# EAGLE design power_control (EAGLE 6.4)

## Sheet 1 of 4: Power
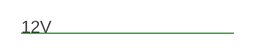
[diagram p0: schematic, sheet 1]

## Sheet 2 of 4: B-t-B
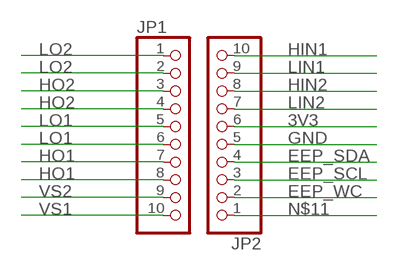
[diagram p1: schematic, sheet 2]

### Parts
JP1  PINHD-1X10_2.54-SMD  [1X10SMD]
JP2  PINHD-1X10_2.54-SMD  [1X10SMD]

### Nets
3V3: JP2.6 ; also sheet 4
EEP_SCL: JP2.3 ; also sheet 4
EEP_SDA: JP2.4 ; also sheet 4
EEP_WC: JP2.2 ; also sheet 4
GND: JP2.5 ; also sheet 3,4
HIN1: JP2.10 ; also sheet 3
HIN2: JP2.8 ; also sheet 3
HO1: JP1.7 JP1.8 ; also sheet 3
HO2: JP1.3 JP1.4 ; also sheet 3
LIN1: JP2.9 ; also sheet 3
LIN2: JP2.7 ; also sheet 3
LO1: JP1.5 JP1.6 ; also sheet 3
LO2: JP1.1 JP1.2 ; also sheet 3
N$11: JP2.1
VS1: JP1.10 ; also sheet 3
VS2: JP1.9 ; also sheet 3

## Sheet 3 of 4: IR2101
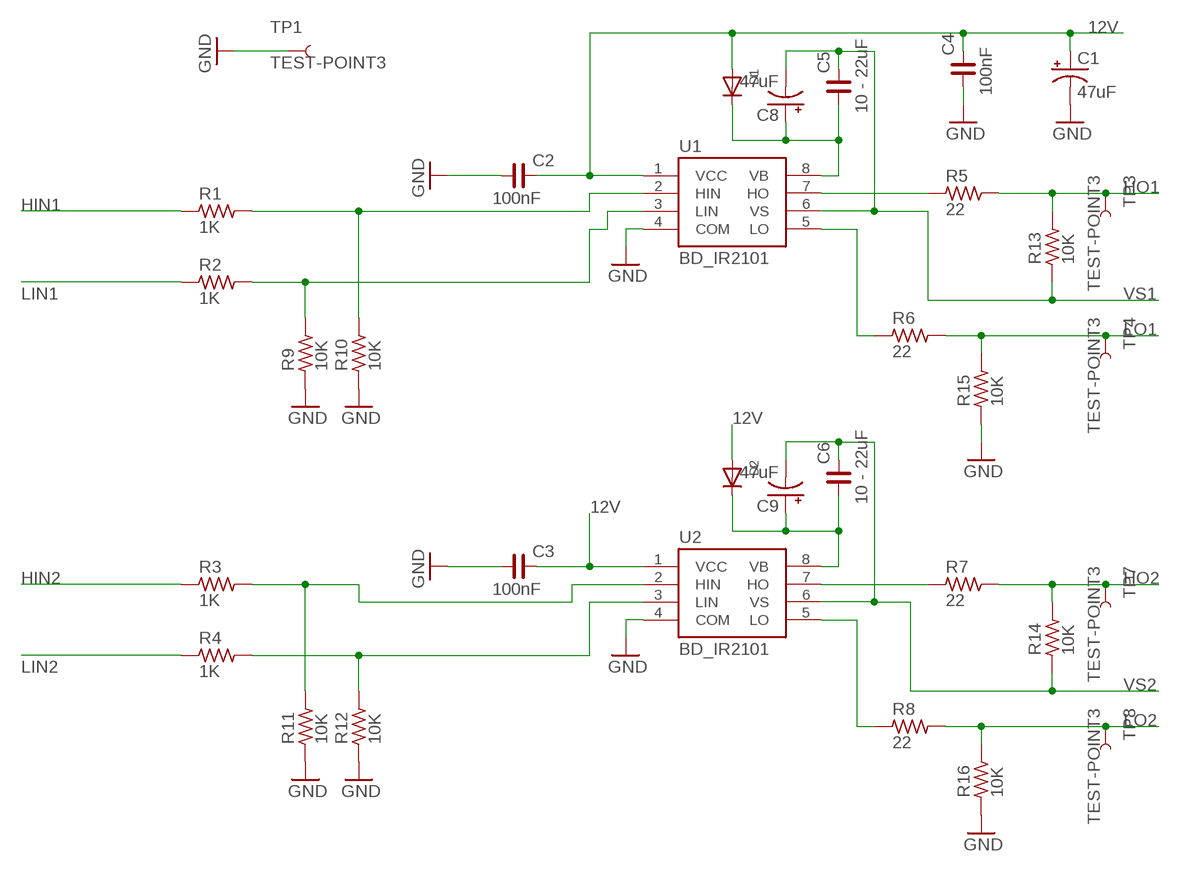
[diagram p2: schematic, sheet 3]

### Parts
C1  47uF  CPOL-USB/3528-21W  [B/3528-21W]
C2  100nF  C_0201  [C0201]
C3  100nF  C_0201  [C0201]
C4  100nF  C_0201  [C0201]
C5  10 - 22uF  C_0805  [C0805]
C6  10 - 22uF  C_0805  [C0805]
C8  47uF  CPOL-USB/3528-21W  [B/3528-21W]
C9  47uF  CPOL-USB/3528-21W  [B/3528-21W]
D1  DIODESOD-523  [SOD-523]
D2  DIODESOD-523  [SOD-523]
R1  1K  R_0201  [R0201]
R2  1K  R_0201  [R0201]
R3  1K  R_0201  [R0201]
R4  1K  R_0201  [R0201]
R5  22  R_0805  [R0805]
R6  22  R_0805  [R0805]
R7  22  R_0805  [R0805]
R8  22  R_0805  [R0805]
R9  10K  R_0201  [R0201]
R10  10K  R_0201  [R0201]
R11  10K  R_0201  [R0201]
R12  10K  R_0201  [R0201]
R13  10K  R_0805  [R0805]
R14  10K  R_0805  [R0805]
R15  10K  R_0805  [R0805]
R16  10K  R_0805  [R0805]
TP1  TEST-POINT3  [PAD.03X.03]
TP3  TEST-POINT3  [PAD.03X.03]
TP4  TEST-POINT3  [PAD.03X.03]
TP7  TEST-POINT3  [PAD.03X.03]
TP8  TEST-POINT3  [PAD.03X.03]
U1  BD_IR2101  [SO8]
U2  BD_IR2101  [SO8]

### Nets
12V: C1.+ C2.2 C3.2 C4.2 D1.A D2.A U1.1(VCC) U2.1(VCC) ; also sheet 1
GND: C1.- C2.1 C3.1 C4.1 R9.1 R10.1 R11.1 R12.1 R15.1 R16.1 TP1.P$1 U1.4(COM) U2.4(COM) ; also sheet 2,4
HIN1: R1.1 ; also sheet 2
HIN2: R3.1 ; also sheet 2
HO1: R5.2 R13.2 TP3.P$1 ; also sheet 2
HO2: R7.2 R14.2 TP7.P$1 ; also sheet 2
LIN1: R2.1 ; also sheet 2
LIN2: R4.1 ; also sheet 2
LO1: R6.2 R15.2 TP4.P$1 ; also sheet 2
LO2: R8.2 R16.2 TP8.P$1 ; also sheet 2
N$1: C6.1 C9.+ D2.K(C) U2.8(VB)
N$2: C5.1 C8.+ D1.K(C) U1.8(VB)
N$7: R1.2 R10.2 U1.2(HIN)
N$12: R2.2 R9.2 U1.3(LIN)
N$18: R5.1 U1.7(HO)
N$20: R6.1 U1.5(LO)
N$33: R3.2 R11.2 U2.2(HIN)
N$34: R4.2 R12.2 U2.3(LIN)
N$38: R7.1 U2.7(HO)
N$40: R8.1 U2.5(LO)
VS1: C5.2 C8.- R13.1 U1.6(VS) ; also sheet 2
VS2: C6.2 C9.- R14.1 U2.6(VS) ; also sheet 2

## Sheet 4 of 4: EEPROM
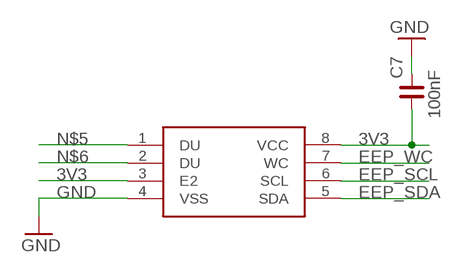
[diagram p3: schematic, sheet 4]

### Parts
C7  100nF  C_0201  [C0201]
M24M02  M24M02-DRMN6TP  [SO08]

### Nets
3V3: C7.1 M24M02.3(E2) M24M02.8(VCC) ; also sheet 2
EEP_SCL: M24M02.6(SCL) ; also sheet 2
EEP_SDA: M24M02.5(SDA) ; also sheet 2
EEP_WC: M24M02.7(WC) ; also sheet 2
GND: C7.2 M24M02.4(VSS) ; also sheet 2,3
N$5: M24M02.1(DU)
N$6: M24M02.2(DU)

## Library data of the parts
C1 C8 C9 = adafruit:CPOL-US: POLARIZED CAPACITOR, American symbol
C2-C7 = rc-master-smd:C_: NON-POLARIZED CAP
D1 D2 = adafruit:DIODE: Diode SMADIODE - SMA Surface Mount Package 20V 1A Schottky Diode Digikey: 641-1014-6-ND DO-1N4148 - Through Hole Small Current Diode SOD-123 20V 1 A (.5mV Vf) Schottky Diode - Digikey: MBRX120TPMSCT-ND SOD-323 10V 570mA (.38mV Vf, 3ns) Schottky Diode - Digikey: ZLLS410CT-ND SOD-523 30V 30mA Schottky Diode (RB751S-40TE61) - Digikey: RB751S-40TE61CT-ND SOT23-R/W - SOT23 Package (R = Solder Paste/Reflow Ovens, W = Hand-Soldering) BAT54Film 40V 300mA - Digikey: 497-7162-1-ND
JP1 JP2 = pinhead-1:PINHD-1X10: PIN HEADER
M24M02 = st-microelectronics:M24M02-DRMN6TP
R1-R16 = rc-master-smd:R_: RESISTOR
TP1 TP3 TP4 TP7 TP8 = SparkFun-Passives:TEST-POINT: Bare copper test points for troubleshooting or ICT
U1 U2 = open-bldc:BD

## Board
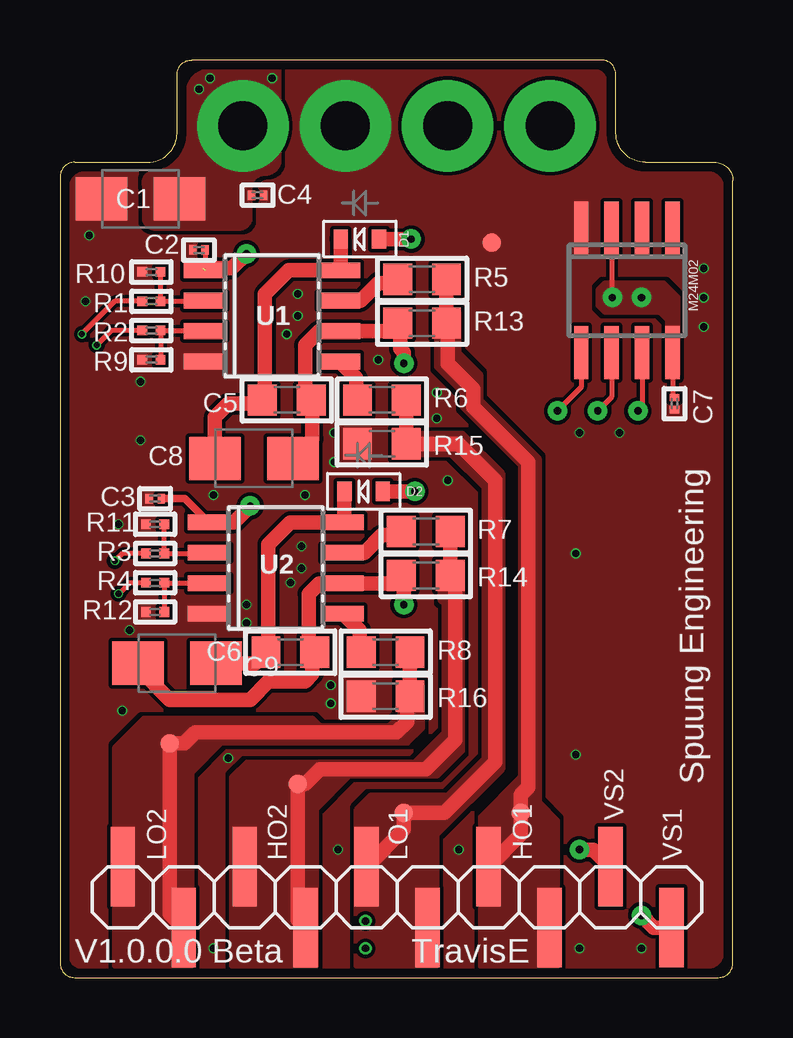
[diagram p4: board, top side]
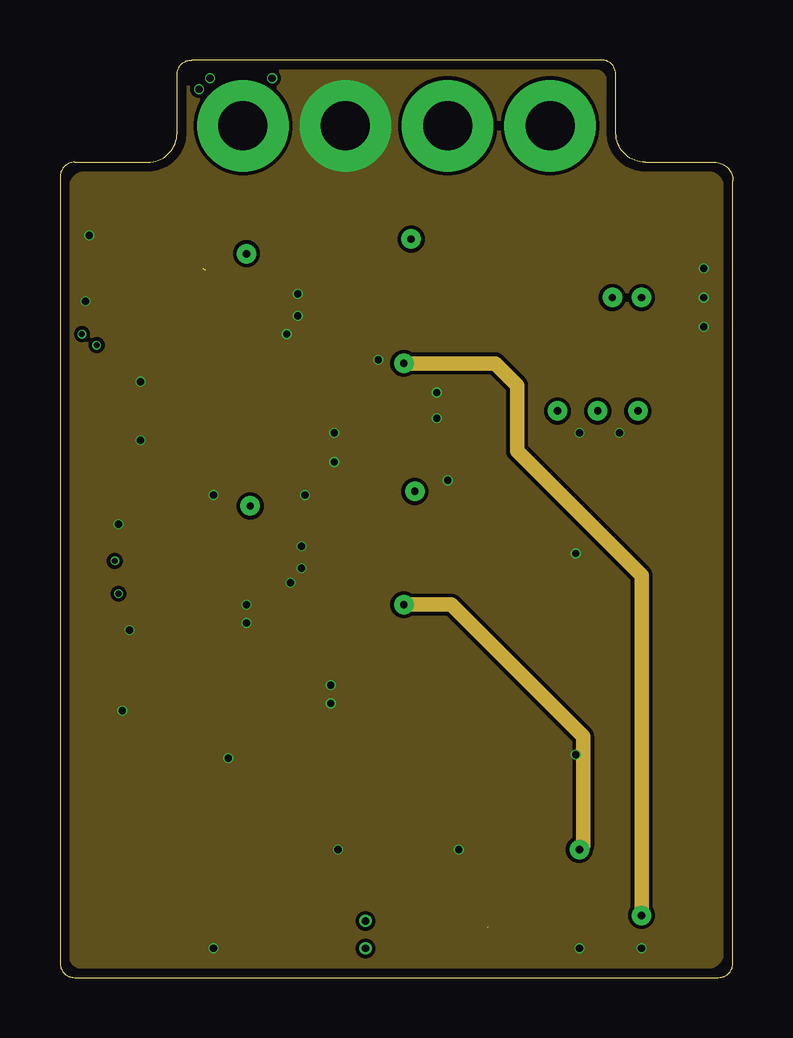
[diagram p5: board, inner layer Route2]
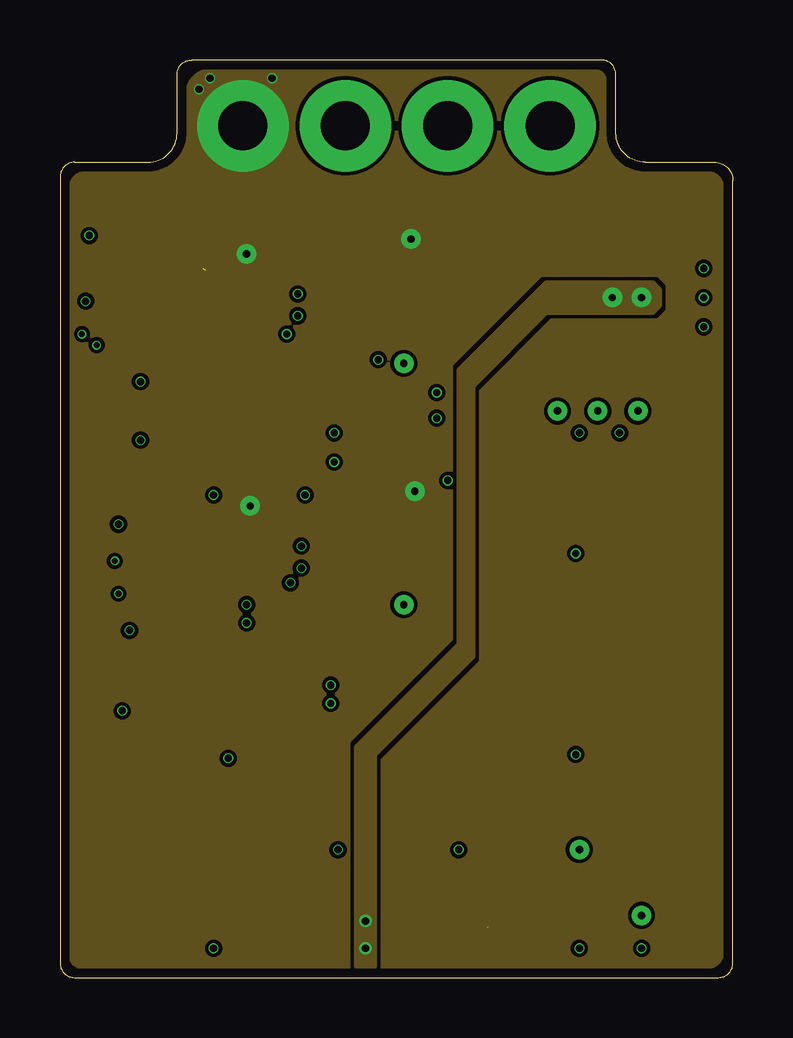
[diagram p6: board, inner layer Route3]
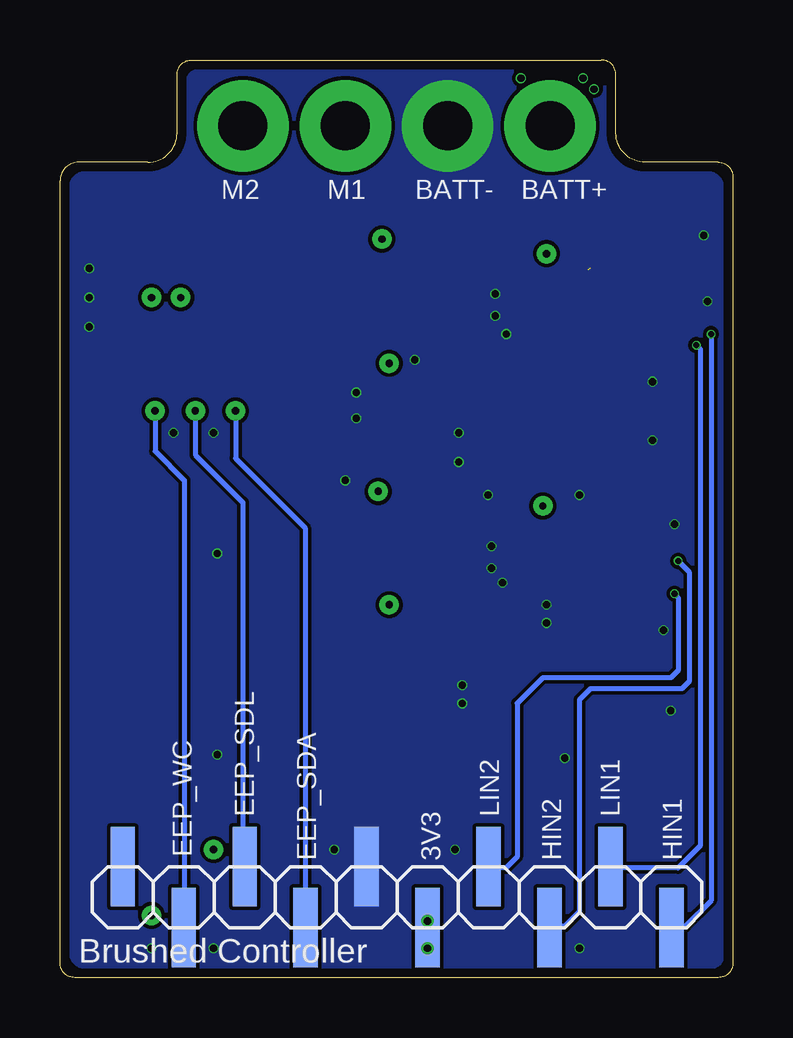
[diagram p7: board, bottom side, seen from below]

Size 28.04 x 38.25 mm. Coordinates in mm from the lower left corner, seen from the top.
Outline: 0.61,0 27.43,0 arc90 28.04,0.61 28.04,33.22 arc90 27.28,33.99 24.38,33.99 arc-90 23.17,35.2 23.17,37.64 arc90 22.56,38.25 5.49,38.25 arc90 4.88,37.64 4.88,35.2 arc-90 3.66,33.99 0.61,33.99 arc90 0,33.38 0,0.61 arc90 0.61,0
Copper layers (1*2*3*16): Top 0.035559375mm / dielectric 0.17018125mm / Route2 0.01778125mm / dielectric 47mil / Route3 0.01778125mm / dielectric 0.17018125mm / Bottom 0.035559375mm
Design rules "LaenPCBOrder *": minimum track width 5mil, minimum drill 10mil, track to track 6mil, track to pad 6mil, pad to pad 6mil, via to via 6mil, smd to smd 6mil, copper to edge 15mil, drill to drill 6mil, minimum pad ring 1mil, minimum via ring 1mil, stop-mask expansion 4mil, vias tented up to drill 13mil, thermal gap 10mil

### Footprints (pad centres in the part's own frame; a part is rotated, then mirrored left to right if it is on the bottom)
B/3528-21W = smd 2.15 x 1.8: + 1.625,0; - -1.625,0
C0201 = smd 0.3 x 0.4: 1 -0.254,0; 2 0.254,0
C0805 = smd 1.2 x 1.3: 1 -1.016,0; 2 1.016,0
SOD-523 = smd 0.8 x 0.6: A 0,-0.8; K 0,0.8
1X10SMD = smd 1.016 x 3.302: 1 -1.27,1.27; 2 1.27,-1.27; 3 3.81,1.27; 4 6.35,-1.27; 5 8.89,1.27; 6 11.43,-1.27; 7 13.97,1.27; 8 16.51,-1.27; 9 19.05,1.27; 10 21.59,-1.27
SO08 = smd 0.6 x 2.2: 1 -1.905,-2.6; 2 -0.635,-2.6; 3 0.635,-2.6; 4 1.905,-2.6; 5 1.905,2.6; 6 0.635,2.6; 7 -0.635,2.6; 8 -1.905,2.6
R0201 = smd 0.4 x 0.4: 1 -0.381,0; 2 0.381,0
R0805 = smd 1.2 x 1.3: 1 -1.016,0; 2 1.016,0
PAD.03X.03 = smd 0.762 x 0.762: P$1 0,0
SO8 = smd 0.65 x 1.75: 1 -1.905,-2.8; 2 -0.635,-2.8; 3 0.635,-2.8; 4 1.905,-2.8; 5 1.905,2.8; 6 0.635,2.8; 7 -0.635,2.8; 8 -1.905,2.8

### Placement (x,y rotation side)
C1  3.35,32.46 0 top
C2  5.79,30.33 0 top
C3  3.96,19.96 0 top
C4  8.23,32.61 180 top
C5  9.45,24.08 0 top
C6  9.6,13.56 0 top
C7  25.6,23.93 270 top
C8  8.08,21.64 180 top
C9  4.88,13.11 0 top
D1  12.5,30.78 90 top
D2  12.65,20.27 90 top
JP1  3.89,3.35 0 top
JP2  24.16,3.35 0 bottom
M24M02  23.62,28.65 180 top
R1  3.81,28.19 0 top
R2  3.81,26.97 0 top
R3  3.96,17.68 0 top
R4  3.96,16.46 0 top
R5  15.09,29.11 0 top
R6  13.41,24.08 0 top
R7  15.24,18.59 0 top
R8  13.56,13.56 0 top
R9  3.81,25.76 0 top
R10  3.81,29.41 0 top
R11  3.96,18.9 0 top
R12  3.96,15.24 0 top
R13  15.09,27.28 0 top
R14  15.24,16.76 0 top
R15  13.41,22.25 0 top
R16  13.56,11.73 0 top
TP1  17.98,30.63 0 top
TP3  19.2,6.86 0 top
TP4  14.33,6.86 0 top
TP7  9.91,8.08 0 top
TP8  4.57,9.75 0 top
U1  8.84,27.58 270 top
U2  8.99,17.07 270 top

### Tracks (layer width: path | path; a pad name or v marks a point on that pad's centre or on a via)
3V3  (via drill 0.3 pad 0.51, 0.3 pad 0.81)
  Top 0.203: M24M02.8 25.53,24.26 C7.1 | M24M02.3 22.99,28.37 v23.01,28.35
  Bottom 0.61: JP2.6 v12.73,2.36
  other vias: 24.23,28.35 12.73,1.22
  pour Top (no thermals): 25.3,25.15 25.76,25.15 25.76,28.35 25.15,28.96 22.71,28.96 22.4,28.65 22.4,28.04 22.71,27.74 24.99,27.74 25.3,27.43
  pour Route3 (rank 5): 24.69,28.96 20.27,28.96 16.61,25.3 16.61,13.87 12.34,9.6 12.34,0.46 13.11,0.46 13.11,9.3 17.22,13.41 17.22,24.69 20.27,27.74 24.69,27.74 24.99,28.04 24.99,28.65
12V  (via drill 0.3 pad 0.41, 0.3 pad 0.81, 2.03 pad 3.81)  (1 unrouted)
  Top 0.203: C2.2 U1.1
  Top 0.305: C3.2 5.2,19.96 U2.1
  Top 0.61: D1.A v14.63,30.78 | D2.A v14.78,20.27 | 5.94,29.57 7.16,29.57 v7.77,30.18 | U2.1 7.24,18.97 v7.93,19.66
  other vias: 7.62,35.51 6.25,37.49 8.84,37.49 5.79,37.03
  pour Route3 (rank 6): 22.25,37.8 6.25,37.8 arc90 5.33,36.88 5.33,35.36 arc-90 3.51,33.53 1.07,33.53 arc90 0.46,32.92 0.46,0.91 arc90 0.91,0.46 26.97,0.46 arc90 27.58,1.07 27.58,32.92 arc90 26.97,33.53 24.38,33.53 arc-90 22.71,35.2 22.71,37.34 arc90
  pour Top (rank 5, no thermals): 9.14,37.8 6.25,37.8 arc90 5.33,36.88 5.33,35.2 arc-90 3.81,33.53 arc90 3.51,33.07 3.51,31.7 arc90 3.96,31.24 7.47,31.24 arc90 7.92,31.7 7.92,32.92 arc-90 8.53,33.53 arc90 9.14,34.14
EEP_SCL  (via drill 0.3 pad 0.81)
  Top 0.203: M24M02.6 22.99,24.21 v22.4,23.62
  Bottom 0.203: v22.4,23.62 22.4,21.79 20.42,19.81 20.42,4.7 JP2.3
EEP_SDA  (via drill 0.3 pad 0.81)  (1 unrouted)
  Top 0.203: M24M02.5 21.72,24.61 v20.73,23.62
  Bottom 0.203: v20.73,23.62 20.73,21.64 17.83,18.75 17.83,2.11
EEP_WC  (via drill 0.3 pad 0.81)
  Top 0.203: M24M02.7 24.26,23.8 v24.08,23.62
  Bottom 0.203: v24.08,23.62 24.08,21.95 22.86,20.73 22.86,2.26 JP2.2
GND  (via drill 0.3 pad 0.41, 2.03 pad 3.81)
  other vias: 11.89,35.51 2.59,11.13 9.91,28.5 9.91,27.58 10.06,17.07 2.44,18.9 9.45,26.82 15.7,24.38 15.7,23.32 26.82,29.57 26.82,28.35 26.82,27.13 21.64,22.71 23.32,22.71 10.06,17.98 9.6,16.46 16.15,20.73 21.49,9.3 21.49,17.68 7.01,9.14 11.58,5.33 16.61,5.33 2.9,14.48 3.35,24.84 3.35,22.4 1.22,30.94 1.07,28.19 10.21,20.12 6.4,20.12 13.26,25.76 21.64,1.22 24.23,1.22 11.28,12.19 11.28,11.43 11.43,22.71 11.43,21.49 7.77,15.54 7.77,14.78 6.4,1.22
  pour Top (rank 6, no thermals): 22.25,37.8 6.25,37.8 arc90 5.33,36.88 5.33,35.36 arc-90 3.51,33.53 1.07,33.53 arc90 0.46,32.92 0.46,0.91 arc90 0.91,0.46 26.97,0.46 arc90 27.58,1.07 27.58,32.92 arc90 26.97,33.53 24.38,33.53 arc-90 22.71,35.2 22.71,37.34 arc90
  pour Bottom (rank 6, no thermals): 22.25,37.8 6.25,37.8 arc90 5.33,36.88 5.33,35.36 arc-90 3.51,33.53 1.07,33.53 arc90 0.46,32.92 0.46,0.91 arc90 0.91,0.46 26.97,0.46 arc90 27.58,1.07 27.58,32.92 arc90 26.97,33.53 24.38,33.53 arc-90 22.71,35.2 22.71,37.34 arc90
  pour Route2 (rank 5): 22.25,37.8 6.25,37.8 arc90 5.33,36.88 5.33,35.36 arc-90 3.51,33.53 1.07,33.53 arc90 0.46,32.92 0.46,0.91 arc90 0.91,0.46 26.97,0.46 arc90 27.58,1.07 27.58,32.92 arc90 26.97,33.53 24.38,33.53 arc-90 22.71,35.2 22.71,37.34 arc90
HIN1  (via drill 0.25 pad 0.36)
  Top 0.203: R1.1 2.29,28.19 v0.91,26.82
  Bottom 0.203: v0.91,26.82 0.91,3.2 1.98,2.13 2.52,2.13 JP2.10
HIN2  (via drill 0.25 pad 0.36)
  Top 0.203: R3.1 2.59,17.68 v2.29,17.37
  Bottom 0.203: v2.29,17.37 1.83,16.92 1.83,12.34 2.13,12.04 5.94,12.04 6.4,11.58 6.4,2.74 7.01,2.13 7.59,2.13 JP2.8
HO1
  Top 0.61: R5.2 R13.2 16.15,27.23 16.15,25.6 17.22,24.54 17.22,23.77 19.51,21.49 19.51,7.92 19.2,7.62 TP3.P$1 19.2,5.97 JP1.7
  pour Top (rank 5, no thermals): 20.73,0.46 17.53,0.46 17.53,6.71 19.2,8.38 19.2,21.34 16.76,23.77 16.76,24.38 15.7,25.45 15.7,27.74 16.61,27.74 16.61,26.06 17.53,25.15 17.53,24.08 19.96,21.64 19.96,7.32 20.73,6.55
HO2
  Top 0.61: R7.2 R14.2 16.46,16.56 16.46,9.91 15.24,8.69 10.82,8.69 10.21,8.08 TP7.P$1 9.91,2.41 JP1.4
  pour Top (rank 5, no thermals): 10.67,0.46 7.16,0.46 7.16,8.38 7.77,8.99 14.78,8.99 16,10.21 16,15.54 15.85,15.7 15.85,17.22 16.76,17.22 16.76,9.45 15.7,8.38 12.04,8.38 10.67,7.01
LIN1  (via drill 0.25 pad 0.36)
  Top 0.203: R2.1 2.13,26.97 v1.52,26.37
  Bottom 0.203: v1.52,26.37 1.37,26.21 1.37,5.49 2.29,4.57 5.05,4.57 JP2.9
LIN2  (via drill 0.25 pad 0.36)
  Top 0.203: R4.1 2.9,16.46 v2.44,16
  Bottom 0.203: v2.44,16 2.29,15.85 2.29,12.8 2.59,12.5 7.93,12.5 8.99,11.43 8.99,5.03 9.45,4.57 10.13,4.57 JP2.7
LO1
  Top 0.61: R6.2 R15.2 16.61,22.25 18.14,20.73 18.14,8.99 16,6.86 TP4.P$1 14.33,6.17 JP1.5
  pour Top (rank 5, no thermals): 15.7,0.46 12.34,0.46 12.34,7.01 12.95,7.62 16.15,7.62 17.68,9.14 17.68,20.42 16.31,21.79 14.02,21.79 14.02,22.71 16.76,22.71 18.44,21.03 18.44,8.69 15.7,5.94
LO2
  Top 0.61: R8.2 R16.2 14.48,11.63 14.48,10.67 14.02,10.21 5.64,10.21 5.18,9.75 TP8.P$1 4.57,2.67 JP1.2
  pour Top (rank 5, no thermals): 5.49,0.46 2.29,0.46 2.29,9.6 3.51,10.82 10.52,10.82 10.82,10.52 13.72,10.52 14.17,10.97 14.17,12.19 15.09,12.19 15.09,10.36 14.48,9.75 6.71,9.75 5.49,8.53
N$1
  Top 0.203: 8.69,13.72 C6.1
  Top 0.61: 8.69,13.72 8.69,18.06 9.6,18.97 U2.8 11.85,19.03 D2.K | C9.+ 8.13,13.11 C6.1
N$2
  Top 0.203: 8.53,24.23 C5.1
  Top 0.61: 8.53,24.23 8.53,28.5 9.52,29.49 U1.8 11.7,29.55 D1.K | C5.1 8.28,23.93 7.01,23.93 6.45,23.37 C8.+
N$7
  Top 0.203: R10.2 R1.2 6.01,28.19 U1.2
N$12
  Top 0.203: R9.2 R2.2 6.01,26.97 U1.3
N$18
  Top 0.61: U1.7 12.52,28.22 13.26,28.96 13.92,28.96 R5.1
N$20
  Top 0.61: U1.5 11.66,25.68 12.34,24.99 12.34,24.13 R6.1
N$24  (via drill 2.03 pad 3.81)
  other vias: 20.42,35.51
N$27  (via drill 2.03 pad 3.81)
  other vias: 16.15,35.51
N$33
  Top 0.203: R11.2 R3.2 6.17,17.68 U2.2
N$34
  Top 0.203: R12.2 R4.2 6.17,16.46 U2.3
N$38
  Top 0.61: U2.7 12.68,17.7 13.41,18.44 14.07,18.44 R7.1
N$40
  Top 0.61: U2.5 11.81,15.16 12.5,14.48 12.5,13.61 R8.1
VS1  (via drill 0.3 pad 0.81)
  Top 0.61: C8.- 10.52,22.45 10.52,24.03 C5.2 10.21,24.33 10.21,26.37 10.8,26.95 U1.6 13.74,26.95 R13.1 14.17,27.18 14.17,26.21 14.33,26.06 v14.33,25.6 | JP1.10 24.74,2.08 v24.23,2.59
  Route2 0.61: v24.23,2.59 24.23,16.76 19.05,21.95 19.05,24.69 18.14,25.6 v14.33,25.6
VS2  (via drill 0.3 pad 0.81)
  Top 0.61: v14.33,15.54 14.33,16.66 R14.1 13.89,16.43 U2.6 10.8,16.43 10.36,16 10.36,13.82 C6.2 10.52,13.46 10.52,12.65 10.21,12.34 8.69,12.34 7.93,11.58 4.57,11.58 3.25,12.9 C9.- | v21.64,5.33 22.22,5.33 JP1.9
  Route2 0.61: v14.33,15.54 16.31,15.54 21.79,10.06 21.79,5.49 v21.64,5.33

### Text on the board
tPlace: Spuung Engineering | VS2 | LO2 | HO2 | LO1 | HO1 | VS1 | V1.0.0.0 Beta | TravisE
bPlace: BATT+ | BATT- | M1 | M2 | LIN1 | LIN2 | EEP_SDL | HIN1 | HIN2 | 3V3 | EEP_SDA | EEP_WC | Brushed Controller
Document: Layer Info | TOP: GND | RT2 : GND | RT3: +12V | BTM: GND